# Altium schematic sheet MS7312L_RX_V1.0.SchDoc
size A4
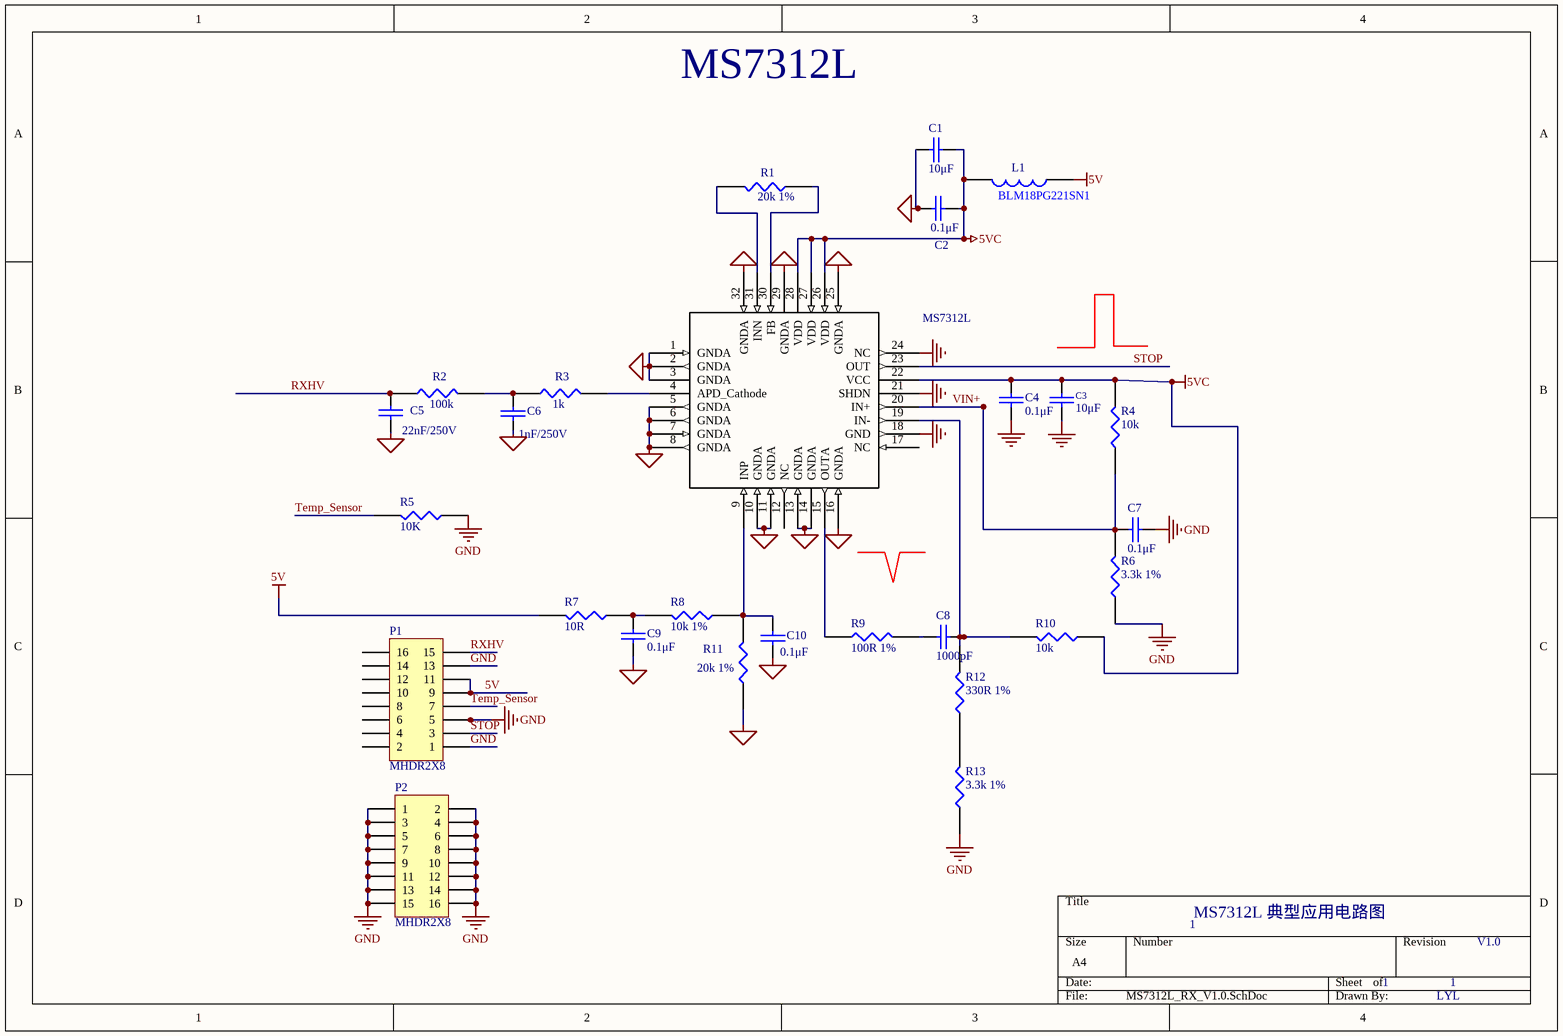
[diagram p0: MS7312L_RX_V1.0.SchDoc]

## Parts
C1  10μF  [0402C]
C2  0.1μF  [0402C]
C3  value 10μF  [0402C]  (hidden comment: GRM155R71H102KA01D)
C4  0.1μF  [0402C]
C5  22nF/250V  [0402C]
C6  1nF/250V  [0402C]
C7  0.1μF  [0402C]
C8  1000pF  [0402C]
C9  0.1μF  [0402C]
C10  0.1μF  [0402C]
L1  BLM18PG221SN1  [L 0603]
P1  MHDR2X8  [HDR2.54-M-LS-2x8P]
P2  MHDR2X8  [HDR2.54-M-LS-2x8P]
R1  20k 1%  [0402]
R2  100k  [0402]
R3  1k  [0402]
R4  10k  [0402]
R5  10K  [0402]
R6  3.3k 1%  [0402]
R7  10R  [0402]
R8  10k 1%  [0402]
R9  100R 1%  [0402]
R10  10k  [0402]
R11  20k 1%  [0402]
R12  330R 1%  [0402]
R13  3.3k 1%  [0402]
U1  MS7312L  [MS7312L]

## Nets
5V: L1.1 P1.9 P1.11 R7.2
5VC: C1.2 C2.1 C3.1 C4.1 L1.2 R4.2 R10.1 U1.22(VCC) U1.26(VDD) U1.27(VDD) U1.28(VDD)
GND: C1.1 C2.2 C3.2 C4.2 C5.2 C6.2 C7.2 C9.1 C10.2 P1.1 P1.5 P1.13 P2.1 P2.2 P2.3 P2.4 P2.5 P2.6 P2.7 P2.8 P2.9 P2.10 P2.11 P2.12 P2.13 P2.14 P2.15 P2.16 R5.1 R6.1 R11.1 R13.1 U1.1(GNDA) U1.2(GNDA) U1.3(GNDA) U1.5(GNDA) U1.6(GNDA) U1.7(GNDA) U1.8(GNDA) U1.10(GNDA) U1.11(GNDA) U1.13(GNDA) U1.14(GNDA) U1.16(GNDA) U1.18(GND) U1.21(SHDN) U1.24(NC) U1.25(GNDA) U1.29(GNDA) U1.32(GNDA)
RXHV: C5.1 P1.15 R2.1
STOP: P1.3 U1.23(OUT)
Temp_Sensor: P1.7 R5.2
VIN+: C7.1 R4.1 R6.2 U1.20(IN+)
NetC6_1: C6.1 R2.2 R3.1
NetC8_1: C8.1 R9.2
NetC8_2: C8.2 R10.2 R12.2 U1.19(IN-)
NetC9_2: C9.2 R7.1 R8.2
NetC10_1: C10.1 R8.1 R11.2 U1.9(INP)
NetR1_1: R1.1 U1.30(FB)
NetR1_2: R1.2 U1.31(INN)
NetR3_2: R3.2 U1.4(APD_Cathode)
NetR9_1: R9.1 U1.15(OUTA)
NetR12_1: R12.1 R13.2

Not connected (* = marked no-connect by the designer): P1 2 4 6 8 10 12 14 16; U1 12(NC) 17(NC)

## Notes on the sheet
- MS7312L
- MS7312L 典型应用电路图
- 1
- V1.0
- LYL

## Library data of the parts
C1 C2 C4-C10 = CAP: Capacitor
C3 = CAP: Murata - 1nF, 50V, X7R, 10%
L1 = INDUCTOR: HZ1608U102TF; Manufacturer: 顺络; Package: L 0603; PartNumber: HZ1608U102TF; Value: HZ1608U102TF
P1 P2 = MHDR2X8: Header, 8-Pin, Dual row; LatestRevisionDate: 17-Jul-2002; LatestRevisionNote: Re-released for DXP Platform.; Publisher: Altium Limited
R1-R13 = RES1